# EAGLE schematic comparator (EAGLE 7.2.0)
CNAME: LM358 Comparator; CREVISION: 0.1; DESIGNER: dru (RNDC)
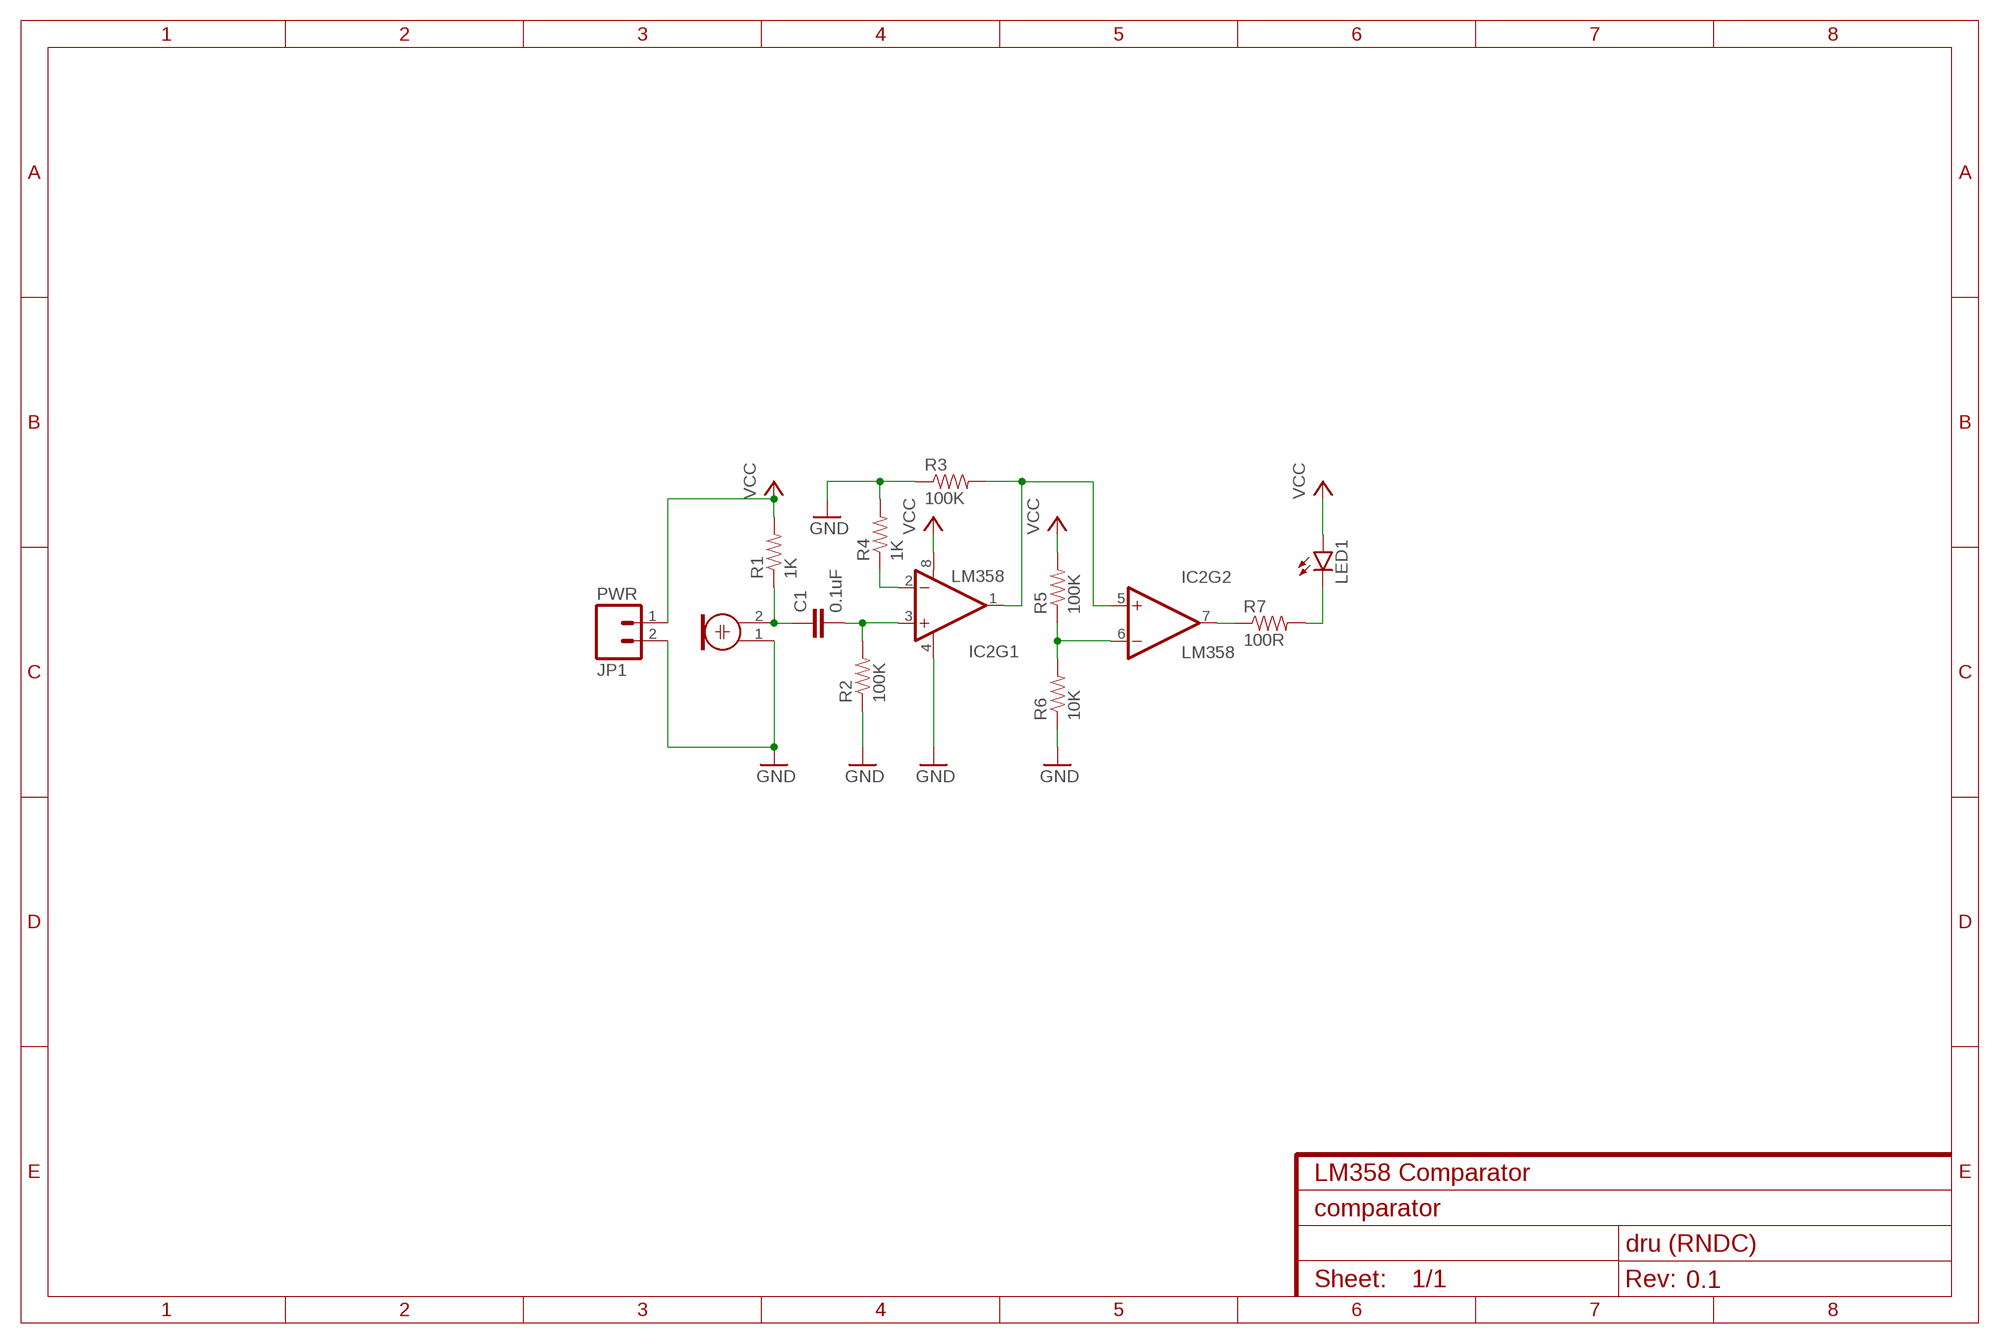
[diagram p0: schematic, sheet 1]

## Parts
C1  0.1uF  CAPPTH1  [CAP-PTH-5MM]
IC2  LM358  [DIP08]
JP1  PWR  M02PTH3  [1X02_LONGPADS]
LED1  LED5MM  [LED5MM]
MIC  ELECTRET_MICROPHON-WM-61B  [WM-61B]
R1  1K  RESISTOREZ  [AXIAL-0.3EZ]
R2  100K  RESISTOREZ  [AXIAL-0.3EZ]
R3  100K  RESISTOREZ  [AXIAL-0.3EZ]
R4  1K  RESISTOREZ  [AXIAL-0.3EZ]
R5  100K  RESISTOREZ  [AXIAL-0.3EZ]
R6  10K  RESISTOREZ  [AXIAL-0.3EZ]
R7  100R  RESISTOREZ  [AXIAL-0.3EZ]

## Nets
GND: IC2.4(V-) JP1.2 MIC.1 R2.P$1 R3.P$1 R4.P$2 R6.P$1
N$1: C1.1 MIC.2 R1.P$1
N$2: C1.2 IC2.3(+IN) R2.P$2
N$3: IC2.2(-IN) R4.P$1
N$4: IC2.1(OUT) IC2.5(+IN) R3.P$2
N$5: IC2.6(-IN) R5.P$1 R6.P$2
N$6: IC2.7(OUT) R7.P$1
N$7: LED1.K(C) R7.P$2
VCC: IC2.8(V+) JP1.1 LED1.A R1.P$2 R5.P$2

## Library data of the parts
C1 = SparkFun-Passives:CAP: Capacitor Standard 0603 ceramic capacitor, and 0.1" leaded capacitor.
IC2 = SparkFun-AnalogIC:LM358: Jellybean op-amp; PROD_ID: IC-09172
JP1 = SparkFun-Connectors:M02: Standard 2-pin 0.1" header. Use with - straight break away headers ( PRT-00116) - right angle break away headers (PRT-00553) - swiss pins (PRT-00743) - machine pins (PRT-00117) - female headers (PRT-00115) Molex polarized connector foot print use with: PRT-08233 with associated crimp pins and housings. 2.54_SCREWTERM for use with PRT-10571. 3.5mm Screw Terminal footprints for PRT-08084 5mm Screw Terminal footprints for use with PRT-08432
LED1 = SparkFun-LED:LED: LEDs Standard schematic elements and footprints for 5mm, 3mm, 1206, and 0603 sized LEDs. 5mm - Spark Fun Electronics SKU : COM-00529 (and others)
MIC = microphon:ELECTRET_MICROPHON-: Electret Condenser Microphone
R1-R7 = SparkFun-Passives:RESISTOR: Resistor Basic schematic elements and footprints for 0603, 1206, and PTH resistors.